# Altium schematic sheet DAC and MIC.SchDoc
size A4; SheetNumber: 5; SheetTotal: 10
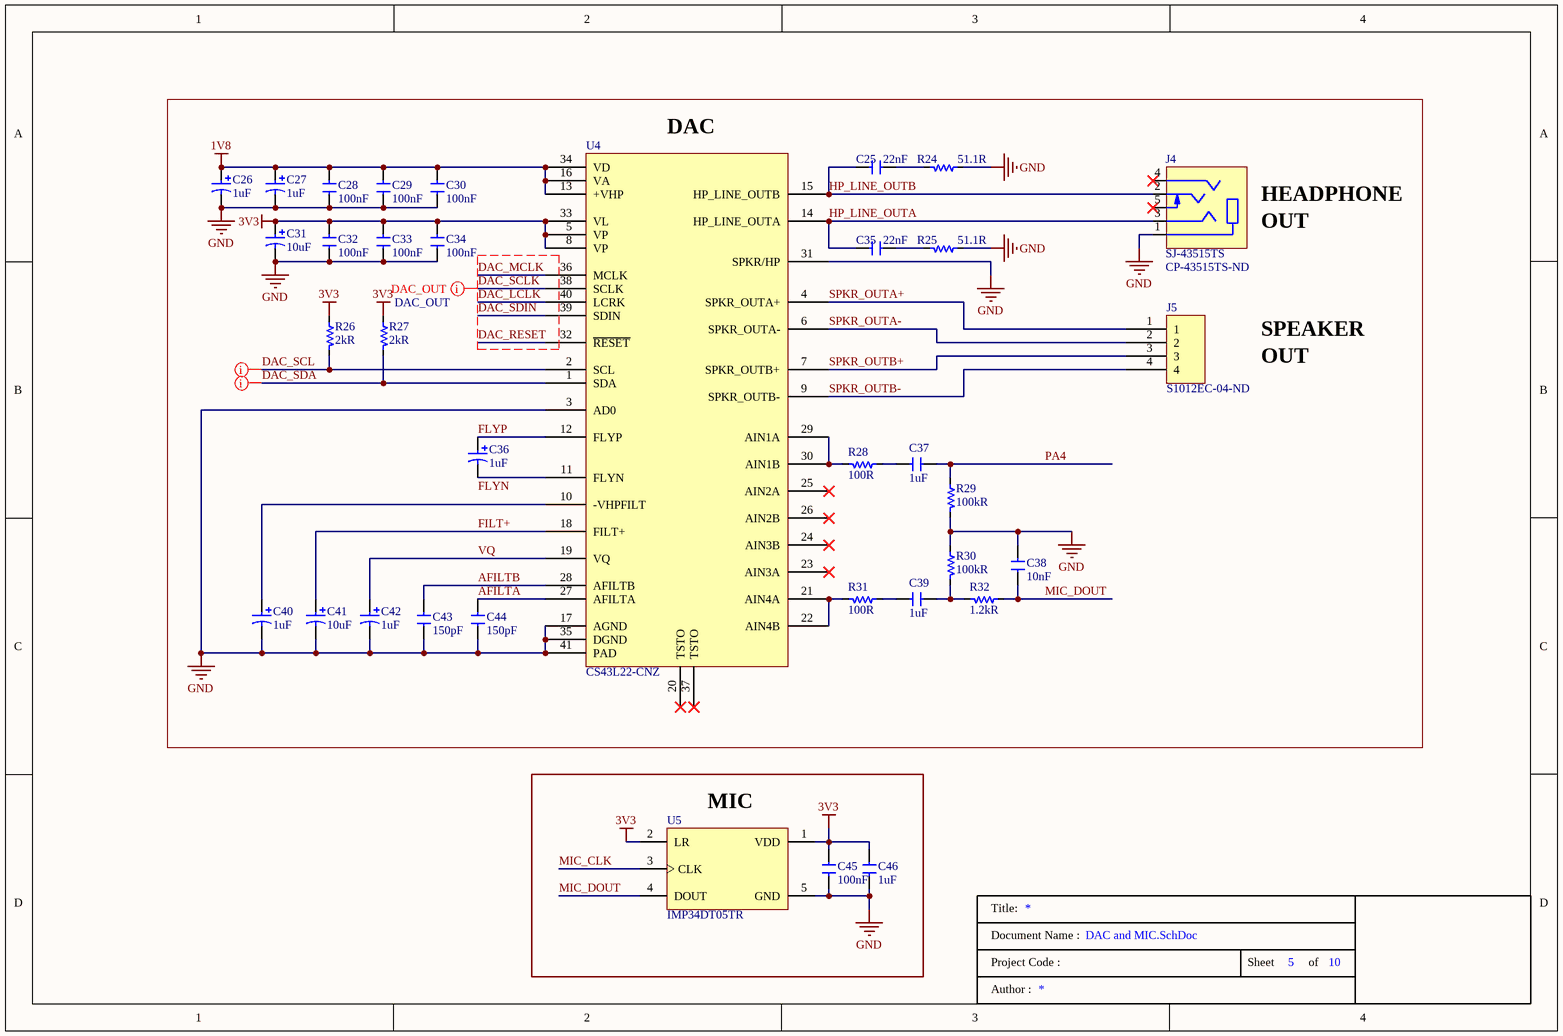
[diagram p0: DAC and MIC.SchDoc]

## Parts
C25  Capacitance: 22nF  [0805_CAP]  (hidden comment: CAP_22nF_50V_0805_X7R_CER)
C26  Capacitance: 1uF  [1206_TANT_CAP]  (hidden comment: CAP_1uF_10%_16V_1206_TANT)
C27  Capacitance: 1uF  [1206_TANT_CAP]  (hidden comment: CAP_1uF_10%_16V_1206_TANT)
C28  Capacitance: 100nF  [0805_CAP]  (hidden comment: CAP_0.1uF_50V_0805_X7R_CER)
C29  Capacitance: 100nF  [0805_CAP]  (hidden comment: CAP_0.1uF_50V_0805_X7R_CER)
C30  Capacitance: 100nF  [0805_CAP]  (hidden comment: CAP_0.1uF_50V_0805_X7R_CER)
C31  Capacitance: 10uF  [1206_TANT_CAP]  (hidden comment: CAP_10uF_10V_10%_1206_TANT)
C32  Capacitance: 100nF  [0805_CAP]  (hidden comment: CAP_0.1uF_50V_0805_X7R_CER)
C33  Capacitance: 100nF  [0805_CAP]  (hidden comment: CAP_0.1uF_50V_0805_X7R_CER)
C34  Capacitance: 100nF  [0805_CAP]  (hidden comment: CAP_0.1uF_50V_0805_X7R_CER)
C35  Capacitance: 22nF  [0805_CAP]  (hidden comment: CAP_22nF_50V_0805_X7R_CER)
C36  Capacitance: 1uF  [1206_TANT_CAP]  (hidden comment: CAP_1uF_10%_16V_1206_TANT)
C37  1uF  [0805_CAP]
C38  Capacitance: 10nF  [0805_CAP]  (hidden comment: CAP_10nF_%10_50V_0805_X7R_CER)
C39  1uF  [0805_CAP]
C40  Capacitance: 1uF  [1206_TANT_CAP]  (hidden comment: CAP_1uF_10%_16V_1206_TANT)
C41  Capacitance: 10uF  [1206_TANT_CAP]  (hidden comment: CAP_10uF_10V_10%_1206_TANT)
C42  Capacitance: 1uF  [1206_TANT_CAP]  (hidden comment: CAP_1uF_10%_16V_1206_TANT)
C43  Capacitance: 150pF  [0805_CAP]  (hidden comment: CAP_150pF_%5_50V_0805_C0G/NP0_CER)
C44  Capacitance: 150pF  [0805_CAP]  (hidden comment: CAP_150pF_%5_50V_0805_C0G/NP0_CER)
C45  Capacitance: 100nF  [0805_CAP]  (hidden comment: CAP_0.1uF_50V_0805_X7R_CER)
C46  1uF  [0805_CAP]
J4  SJ-43515TS  Supplier Part Number 1: CP-43515TS-ND  [CONN TRSS HEADPHONE JACK]
J5  Supplier Part Number 1: S1012EC-04-ND  [DIP_1X4_MALE_HEADER_2.54_PITCH]  (hidden comment: CONN_1X4_2.54mm_Male Header)
R24  Resistance: 51.1R  [0805_RES]  (hidden comment: RES_51.1 OHM_1%_0805_1/8W)
R25  Resistance: 51.1R  [0805_RES]  (hidden comment: RES_51.1 OHM_1%_0805_1/8W)
R26  Resistance: 2kR  [0805_RES]  (hidden comment: RES_2K OHM_1%_0805_1/8W_SMD)
R27  Resistance: 2kR  [0805_RES]  (hidden comment: RES_2K OHM_1%_0805_1/8W_SMD)
R28  Resistance: 100R  [0805_RES]  (hidden comment: RES_100 OHM_1%_0805_1/8W)
R29  100kR  [0805_RES]
R30  100kR  [0805_RES]
R31  Resistance: 100R  [0805_RES]  (hidden comment: RES_100 OHM_1%_0805_1/8W)
R32  1.2kR  [0805_RES]
U4  Manufacturer Part Number: CS43L22-CNZ  [QFN50P600X600X100_HS-41N]  (hidden comment: IC_CODEC_CS43L22)
U5  IMP34DT05TR  [MIC_IMP34DT05TR]

## Blocks framed on the sheet
MIC: C45 C46 U5

## Nets
1V8: C26.1 C27.1 C28.2 C29.2 C30.2 U4.13(+VHP) U4.16(VA) U4.34(VD)
3V3: C31.1 C32.2 C33.2 C34.2 C45.2 C46.2 R26.2 R27.2 U4.5(VP) U4.8(VP) U4.33(VL) U5.1(VDD) U5.2(LR)
GND: C26.2 C27.2 C28.1 C29.1 C30.1 C31.2 C32.1 C33.1 C34.1 C38.1 C40.2 C41.2 C42.2 C43.1 C44.1 C45.1 C46.1 J4.1(SLEEVE) R24.2 R25.2 R29.1 R30.2 U4.3(AD0) U4.17(AGND) U4.31(SPKR/HP) U4.35(DGND) U4.41(PAD) U5.5(GND)
AFILTA: C44.2 U4.27(AFILTA)
AFILTB: C43.2 U4.28(AFILTB)
DAC_LCLK: U4.40(LCRK)
DAC_MCLK: U4.36(MCLK)
DAC_RESET: U4.32(~{RESET})
DAC_SCL: R26.1 U4.2(SCL)
DAC_SCLK: U4.38(SCLK)
DAC_SDA: R27.1 U4.1(SDA)
DAC_SDIN: U4.39(SDIN)
FILT+: C41.1 U4.18(FILT+)
FLYN: C36.2 U4.11(FLYN)
FLYP: C36.1 U4.12(FLYP)
HP_LINE_OUTA: C35.1 J4.3(RING1) U4.14(HP_LINE_OUTA)
HP_LINE_OUTB: C25.1 J4.2(TIP) U4.15(HP_LINE_OUTB)
MIC_CLK: U5.3(CLK)
MIC_DOUT: C38.2 R32.2 U5.4(DOUT)
PA4: C37.2 R29.2
SPKR_OUTA+: J5.1 U4.4(SPKR_OUTA+)
SPKR_OUTA-: J5.2 U4.6(SPKR_OUTA-)
SPKR_OUTB+: J5.3 U4.7(SPKR_OUTB+)
SPKR_OUTB-: J5.4 U4.9(SPKR_OUTB-)
VQ: C42.1 U4.19(VQ)
NetC25_2: C25.2 R24.1
NetC35_2: C35.2 R25.1
NetC37_1: C37.1 R28.2
NetC39_1: C39.1 R31.2
NetC39_2: C39.2 R30.1 R32.1
NetC40_1: C40.1 U4.10(-VHPFILT)
NetR28_1: R28.1 U4.29(AIN1A) U4.30(AIN1B)
NetR31_1: R31.1 U4.21(AIN4A) U4.22(AIN4B)

Not connected (* = marked no-connect by the designer): J4 4(RING2)* 5(TIP_SWITCH)*; U4 20(TSTO)* 23(AIN3A)* 24(AIN3B)* 25(AIN2A)* 26(AIN2B)* 37(TSTO)*

## Layout directives
net class DAC_OUT: DAC_SCL, DAC_SCLK, DAC_SDA

## Notes on the sheet
- (near U4) DAC
- HEADPHONE
- OUT
- SPEAKER
- Title:
- Document Name :
- Project Code :
- Sheet
- of
- Author :

## Library data of the parts
C25 C35 = CAP_22nF_50V_0805_X7R_CER: Cap Ceramic 0.022uF 50V X7R 10% Pad SMD 0805 125C T/R; Manufacturer: KEMET; Manufacturer Part Number: C0805C223K5RAC7210; Supplier 1: Digi-Key; RoHS: Yes; Category: Ceramic Capacitors; Stock 1: 39697; Pricing 1: 1=0,10000, 10=0,05200, 50=0,02840, 100=0,02320, 500=0,01656, 1000=0,01301, 2500=0,01182, 5000=0,01088 (USD); Mount: Surface Mount; Case/Package: 0805; Dielectric Material: Ceramic; Min Operating Temperature: -55°C; Max Operating Temperature: 125°C; Tolerance: 10%; Dielectric: X7R; Packaging: Tape and Reel; Voltage Rating (DC): 50V; Construction: Flat; Length: 2mm; Height: 0.78mm; Depth: 1.25mm; Radiation Hardening: No; RoHS Compliant: Yes; ComponentLink1URL: http://components.arrow.com/part/dataview/3451368S8809735N7429?src-supplier=Arrow+Electronics; ComponentLink1Description: http://components.arrow.com/part/dataview/3451368S8809735N7429?src-supplier=Arrow+Electronics; ComponentLink2URL: https://www.verical.com/server-webapp/html/getDatasheet?partID=104142&src-supplier=Verical; ComponentLink2Description: https://www.verical.com/server-webapp/html/getDatasheet?partID=104142&src-supplier=Verical; Supplier Part Number 1: 399-C0805C223K5RAC7210CT-ND
C26 C27 C36 C40 C42 = CAP_1uF_10%_16V_1206_TANT: CAP TANT 1UF 10% 16V 1206; Manufacturer: Kyocera AVX; Manufacturer Part Number: TAJA105K016SNJ; Dielectric Material: Tantalum; Polarity: Polar; ESR (Equivalent Series Resistance): 11R; Dissipation Factor: 4%; RoHS: Yes; Category: Tantalum Capacitors; Stock 1: 6536; Pricing 1: 1=0,34000, 10=0,23300, 50=0,16300, 100=0,13970, 500=0,10480, 1000=0,08849, 2500=0,08384 (USD); Mount: Surface Mount; Case/Package: 1206; Number of Pins: 2; Case Code (Imperial): 1206; Case Code (Metric): 3216; Min Operating Temperature: -55°C; Max Operating Temperature: 125°C; Termination: SMD/SMT; Features: General Purpose; Tolerance: 10%; Voltage Rating (DC): 16V; Packaging: Tape and Reel; Package Quantity: 1; Voltage Rating: 16V; Length: 3.2mm; Width: 1.6mm; Height: 1.8mm; Height - Seated (Max): 0.071inch; Depth: 1.6mm; Radiation Hardening: No; Lead Free: Lead Free; ComponentLink1URL: https://datasheet.ciiva.com/12883/taj-27497-12883493.pdf?src-supplier=Mouser; ComponentLink1Description: https://datasheet.ciiva.com/12883/taj-27497-12883493.pdf?src-supplier=Mouser; ComponentLink2URL: https://datasheet.ciiva.com/6228/taj-6228987.pdf?src-supplier=Digi-Key; ComponentLink2Description: https://datasheet.ciiva.com/6228/taj-6228987.pdf?src-supplier=Digi-Key; ComponentLink3URL: https://datasheet.ciiva.com/6228/taj-6228988.pdf?src-supplier=Digi-Key; ComponentLink3Description: https://datasheet.ciiva.com/6228/taj-6228988.pdf?src-supplier=Digi-Key; ComponentLink4URL: https://datasheet.ciiva.com/6228/taj-6228989.pdf?src-supplier=Digi-Key; ComponentLink4Description: https://datasheet.ciiva.com/6228/taj-6228989.pdf?src-supplier=Digi-Key; Supplier Part Number 1: 478-7525-1-ND; Supplier 1: Digi-Key
C28-C30 C32-C34 C45 = CAP_0.1uF_50V_0805_X7R_CER: Cap Ceramic 0.1uF 50V X7R 20% SMD 0805 125C Paper T/R; Manufacturer: KEMET; Manufacturer Part Number: C0805C104M5RACTU; Supplier 1: Digi-Key; RoHS: Yes; Category: Ceramic Capacitors; Stock 1: 4863; Pricing 1: 1=0,10000, 10=0,06400, 50=0,03500, 100=0,02860, 500=0,02040, 1000=0,01603 (USD); Mount: Surface Mount; Case/Package: 0805; Dielectric Material: Ceramic; Min Operating Temperature: -55°C; Max Operating Temperature: 125°C; Tolerance: 20%; Dielectric: X7R; Packaging: Tape and Reel; Voltage Rating (DC): 50V; Length: 2mm; Height: 0.9mm; Depth: 1.25mm; Radiation Hardening: No; ComponentLink1URL: http://uk.rs-online.com/webdocs/13da/0900766b813daa06.pdf?src-supplier=RSComponents; ComponentLink1Description: http://uk.rs-online.com/webdocs/13da/0900766b813daa06.pdf?src-supplier=RSComponents; ComponentLink2URL: https://www.verical.com/server-webapp/html/getDatasheet?partID=774625&src-supplier=Verical; ComponentLink2Description: https://www.verical.com/server-webapp/html/getDatasheet?partID=774625&src-supplier=Verical; ComponentLink3URL: http://www.farnell.com/datasheets/2739857.pdf?src-supplier=Farnell; ComponentLink3Description: http://www.farnell.com/datasheets/2739857.pdf?src-supplier=Farnell; ComponentLink4URL: http://uk.rs-online.com/webdocs/1515/0900766b81515223.pdf?src-supplier=RSComponents; ComponentLink4Description: http://uk.rs-online.com/webdocs/1515/0900766b81515223.pdf?src-supplier=RSComponents; ComponentLink5URL: http://components.arrow.com/part/dataview/0323_00324812?src-supplier=Arrow+Europe; ComponentLink5Description: http://components.arrow.com/part/dataview/0323_00324812?src-supplier=Arrow+Europe; ComponentLink6URL: http://uk.rs-online.com/webdocs/1528/0900766b81528e2f.pdf?src-supplier=RSComponents; ComponentLink6Description: http://uk.rs-online.com/webdocs/1528/0900766b81528e2f.pdf?src-supplier=RSComponents; ComponentLink7URL: http://www.farnell.com/datasheets/2739857.pdf?src-supplier=Newark; ComponentLink7Description: http://www.farnell.com/datasheets/2739857.pdf?src-supplier=Newark; ComponentLink8URL: http://www.alliedelec.com/m/d/9bfe7773041ffe9d406e68bc7b377fdd.pdf?src-supplier=Allied+Electronics; ComponentLink8Description: http://www.alliedelec.com/m/d/9bfe7773041ffe9d406e68bc7b377fdd.pdf?src-supplier=Allied+Electronics; ComponentLink9URL: https://api.kemet.com/component-edge/download/datasheet/C0805C104M5RACTU.pdf?src-supplier=Digi-Key; ComponentLink9Description: https://api.kemet.com/component-edge/download/datasheet/C0805C104M5RACTU.pdf?src-supplier=Digi-Key; ComponentLink10URL: http://capacitoredge.kemet.com/capedge2/DataSheet?pn=C0805C104M5RACTU&src-supplier=Avnet+Europe; ComponentLink10Description: http://capacitoredge.kemet.com/capedge2/DataSheet?pn=C0805C104M5RACTU&src-supplier=Avnet+Europe; ComponentLink11URL: http://www.farnell.com/datasheets/2739857.pdf?src-supplier=Element14; ComponentLink11Description: http://www.farnell.com/datasheets/2739857.pdf?src-supplier=Element14; ComponentLink12URL: http://www.mouser.com/ds/2/212/KEM_C1002_X7R_SMD-1102033.pdf?src-supplier=Mouser; ComponentLink12Description: http://www.mouser.com/ds/2/212/KEM_C1002_X7R_SMD-1102033.pdf?src-supplier=Mouser; ComponentLink13URL: https://www.verical.com/server-webapp/html/getDatasheet?partID=91523&src-supplier=Verical; ComponentLink13Description: https://www.verical.com/server-webapp/html/getDatasheet?partID=91523&src-supplier=Verical; ComponentLink14URL: http://components.arrow.com/part/dataview/2091108S8109171N7429?src-supplier=Arrow+Electronics; ComponentLink14Description: http://components.arrow.com/part/dataview/2091108S8109171N7429?src-supplier=Arrow+Electronics; Supplier Part Number 1: 399-C0805C104M5RAC7800CT-ND
C31 C41 = CAP_10uF_10V_10%_1206_TANT: Cap Tant Solid 10uF 10V A CASE 10% (3.2 X 1.6 X 1.6mm) Inward L SMD 3216-18 3 Ohm 125C T/R; Manufacturer: Kyocera AVX; Manufacturer Part Number: TAJA106K010SNJ; ESR (Equivalent Series Resistance): 3R; Leakage Current: 1uA; Polarity: Polar; Dissipation Factor: 6%; Supplier 1: Digi-Key; RoHS: Yes; Category: Tantalum Capacitors; Stock 1: 14579; Pricing 1: 1=0,31000, 10=0,21300, 50=0,14920, 100=0,12780, 500=0,09584, 1000=0,08094, 2500=0,07668 (USD); Case/Package: Molded; Number of Pins: 2; Case Code (Imperial): 1206; Case Code (Metric): 3216; Min Operating Temperature: -55°C; Max Operating Temperature: 125°C; Tolerance: 10%; Packaging: Tape and Reel; Voltage Rating: 10V; Package Quantity: 8000; Termination: SMD/SMT; Voltage Rating (DC): 10V; Series: TAJ; Construction: Flat; Length: 3.2mm; Width: 1.6mm; Height: 1.8mm; Depth: 1.6mm; Radiation Hardening: No; Lead Free: Lead Free; RoHS Compliant: Yes; ComponentLink1URL: https://datasheet.ciiva.com/12909/taj-27497-12909898.pdf?src-supplier=Mouser; ComponentLink1Description: https://datasheet.ciiva.com/12909/taj-27497-12909898.pdf?src-supplier=Mouser; Supplier Part Number 1: 478-13122-1-ND
C37 C39 C46 = CAP_1uF_%10_25V_0805_X7R_CER: 陶瓷电容 1uF(105) 1uF ±10% 25V 0805; Manufacturer: Samsung; Manufacturer Part Number: CL21B105KAFNNNG; Material: Ceramic; Dielectric: X7R; Supplier 1: Digi-Key; RoHS: Yes; Category: Ceramic Capacitors; Stock 1: 509034; Pricing 1: 1=0,10000, 10=0,07100, 50=0,03880, 100=0,03170, 500=0,02264, 1000=0,01779 (USD); Mount: Surface Mount; Case/Package: 0805; Case Code (Metric): 2012; Case Code (Imperial): 0805; Min Operating Temperature: -55°C; Max Operating Temperature: 125°C; Tolerance: 10%; Capacitance: 1uF; Voltage Rating: 25V; Package Quantity: 3000; Packaging: Tape and Reel; Voltage: 25V; Series: CL; Length: 2mm; Width: 0.049inch; Height: 1.25mm; Thickness: 0.053inch; Depth: 1.25mm; Radiation Hardening: No; RoHS Compliant: Yes; ComponentLink1URL: https://datasheet.ciiva.com/26920/getdatasheetpartid-698495-26920200.pdf?src-supplier=Verical; ComponentLink1Description: https://datasheet.ciiva.com/26920/getdatasheetpartid-698495-26920200.pdf?src-supplier=Verical; ComponentLink2URL: https://datasheet.ciiva.com/29199/455911-da-01-en-vs-kondensator-0805-29199043.pdf?src-supplier=Conrad; ComponentLink2Description: https://datasheet.ciiva.com/29199/455911-da-01-en-vs-kondensator-0805-29199043.pdf?src-supplier=Conrad; ComponentLink3URL: https://datasheet.ciiva.com/16428/cl05b104kq5nnnc-16428871.pdf?src-supplier=Future+Electronics; ComponentLink3Description: https://datasheet.ciiva.com/16428/cl05b104kq5nnnc-16428871.pdf?src-supplier=Future+Electronics; Supplier Part Number 1: 1276-6469-1-ND
C38 = CAP_10nF_%10_50V_0805_X7R_CER: CAP CER 10000PF 50V X7R 0805; Manufacturer: Samsung; Manufacturer Part Number: CL21B103KBANNNC; Material: Ceramic; Tolerance: 10%; Supplier 1: Digi-Key; RoHS: Yes; Category: Ceramic Capacitors; Stock 1: 1431273; Pricing 1: 1=0,10000, 10=0,04600, 50=0,02500, 100=0,02050, 500=0,01464, 1000=0,01150 (USD); Mount: Surface Mount; Case/Package: 0805; Case Code (Metric): 2012; Case Code (Imperial): 0805; Contact Plating: Tin; Min Operating Temperature: -55°C; Max Operating Temperature: 125°C; Dielectric: X7R; Voltage: 50V; Voltage Rating (DC): 50V; Packaging: Tape and Reel; Voltage Rating: 50V; Series: CL; Construction: Flat; Length: 2mm; Width: 0.049inch; Height: 0.65mm; Depth: 1.25mm; Thickness: 0.03inch; Radiation Hardening: No; Lead Free: Lead Free; RoHS Compliant: Yes; ComponentLink1URL: https://datasheet.ciiva.com/25709/cl21b103kbannnc-25709781.pdf?src-supplier=Digi-Key; ComponentLink1Description: https://datasheet.ciiva.com/25709/cl21b103kbannnc-25709781.pdf?src-supplier=Digi-Key; ComponentLink2URL: https://datasheet.ciiva.com/29199/455082-da-01-en-vs-kondensator-0805-29199459.pdf?src-supplier=Conrad; ComponentLink2Description: https://datasheet.ciiva.com/29199/455082-da-01-en-vs-kondensator-0805-29199459.pdf?src-supplier=Conrad; Supplier Part Number 1: 1276-1015-1-ND
C43 C44 = CAP_150pF_%5_50V_0805_C0G/NP0_CER: 陶瓷电容 150pF(151) 150pF ±5% 50V C0G(NP0) 0805; Manufacturer: KEMET; Manufacturer Part Number: C0805C151J5GACTU; Dielectric Material: Ceramic; Dissipation Factor: 0.1%; Temperature Coefficient: 30ppm/°C; Supplier 1: Digi-Key; RoHS: Yes; Category: Ceramic Capacitors; Stock 1: 90347; Pricing 1: 1=0,10000, 10=0,06800, 50=0,03700, 100=0,03020, 500=0,02156, 1000=0,01694 (USD); Mount: Surface Mount,PCB; Case/Package: 0805; Number of Pins: 2; Case Code (Metric): 2012; Case Code (Imperial): 0805; Contact Material: Tin; Min Operating Temperature: -55°C; Max Operating Temperature: 125°C; Tolerance: 5%; Dielectric: NP0; Package Quantity: 1; Voltage Rating: 50V; Packaging: Tape and Reel; Voltage Rating (DC): 50V; Termination: SMD/SMT; Voltage: 50V; Series: C; Construction: Flat; Length: 2mm; Width: 0.049inch; Height: 0.78mm; Depth: 1.25mm; Thickness: 0.035inch; Lead Pitch: 0.75mm; Radiation Hardening: No; Lead Free: Lead Free; RoHS Compliant: Yes; REACH SVHC: No SVHC; ComponentLink1URL: https://datasheet.ciiva.com/7842/1776095-7842215.pdf?src-supplier=Element14; ComponentLink1Description: https://datasheet.ciiva.com/7842/1776095-7842215.pdf?src-supplier=Element14; ComponentLink2URL: https://datasheet.ciiva.com/144/docfinderpartnumber-c0805c151j5gactu-144656.pdf?src-supplier=Digi-Key; ComponentLink2Description: https://datasheet.ciiva.com/144/docfinderpartnumber-c0805c151j5gactu-144656.pdf?src-supplier=Digi-Key; ComponentLink3URL: https://datasheet.ciiva.com/7842/1372242-7842559.pdf?src-supplier=Element14; ComponentLink3Description: https://datasheet.ciiva.com/7842/1372242-7842559.pdf?src-supplier=Element14; ComponentLink4URL: https://datasheet.ciiva.com/28668/1789732-28668745.pdf?src-supplier=Element14; ComponentLink4Description: https://datasheet.ciiva.com/28668/1789732-28668745.pdf?src-supplier=Element14; ComponentLink5URL: https://datasheet.ciiva.com/14604/70095383-14604153.pdf?src-supplier=Allied+Electronics; ComponentLink5Description: https://datasheet.ciiva.com/14604/70095383-14604153.pdf?src-supplier=Allied+Electronics; ComponentLink6URL: https://datasheet.ciiva.com/14597/70095383-14597037.pdf?src-supplier=Allied+Electronics; ComponentLink6Description: https://datasheet.ciiva.com/14597/70095383-14597037.pdf?src-supplier=Allied+Electronics; ComponentLink7URL: https://datasheet.ciiva.com/2988/kem-c1003-c0g-smd-2988611.pdf?src-supplier=Avnet; ComponentLink7Description: https://datasheet.ciiva.com/2988/kem-c1003-c0g-smd-2988611.pdf?src-supplier=Avnet; ComponentLink8URL: https://datasheet.ciiva.com/2988/kem-c1003-c0g-smd-2988612.pdf?src-supplier=Avnet; ComponentLink8Description: https://datasheet.ciiva.com/2988/kem-c1003-c0g-smd-2988612.pdf?src-supplier=Avnet; Supplier Part Number 1: 399-C0805C151J5GAC7800CT-ND
J4 = CONN_JACK_4COND_3.5MM_R/A: Conn 3.5MM Audio Jack RCP 5 POS RA Thru-Hole 5 Terminal 1 Port; Manufacturer: CUI Devices; Supplier 1: Digi-Key; Manufacturer Part Number: SJ-43515TS; RoHS: Yes; Category: Audio / Video Connectors; Stock 1: 36318; Pricing 1: 1=1,04000, 10=0,87500, 25=0,83880, 40=0,82100, 80=0,78538, 270=0,71400, 540=0,64259, 1080=0,57120, 2430=0,51765 (USD)
J5 = CONN_1X4_2.54mm_Male Header: Connector Header Through Hole 4 position 0.100" (2.54mm); Manufacturer: Sullins; Manufacturer Part Number: PREC004SAAN-RC; Number of Positions: 4; Connector Type: Male Pin; Pitch: 0.1inch; Supplier 1: Digi-Key; RoHS: Yes; Category: Connectors; Stock 1: 2512; Pricing 1: 1=0,12000, 10=0,11200, 25=0,08320, 50=0,07120, 100=0,06890, 250=0,05940, 500=0,05702 (USD); Mount: Through Hole; Color: Black; Contact Plating: Tin; Package Quantity: 1; Number of Rows: 1; Packaging: Bulk; Termination: Solder; Series: -; Contact Type: Male Pin; Contact Mating Length: 0.23inch; RoHS Compliant: Yes; ComponentLink1URL: https://datasheet.ciiva.com/740/zrzczzzszzn-rc-st-11635-b-740841.pdf?src-supplier=Digi-Key; ComponentLink1Description: https://datasheet.ciiva.com/740/zrzczzzszzn-rc-st-11635-b-740841.pdf?src-supplier=Digi-Key
R24 R25 = RES_51.1 OHM_1%_0805_1/8W: 贴片电阻 51.1Ω ± 1.00% 0.125W ± 100ppm/℃ 0805; Manufacturer: Yageo; Manufacturer Part Number: RC0805FR-0751R1L; Tolerance: 1%; Power Rating: 125mW; Voltage Rating: 150V; Temperature Coefficient: 100ppm/°C; Supplier 1: Digi-Key; RoHS: Yes; Category: Chip SMD Resistors; Stock 1: 4296; Pricing 1: 1=0,10000, 10=0,04200, 100=0,01690, 1000=0,00759, 2500=0,00659 (USD); Case/Package: 0805; Case Code (Imperial): 0805; Case Code (Metric): 2012; Min Operating Temperature: -55°C; Max Operating Temperature: 155°C; Packaging: Tape and Reel; Package Quantity: 5000; Termination: SMD/SMT; Resistor Type: Thick Film; Voltage Rating (DC): 150V; Working Voltage: 150V; Number of Terminations: 2; Features: Moisture Resistant; Series: RC; Max Power Dissipation: 125mW; Construction: Rectangular; Technology: THICK FILM; Length: 2mm; Width: 1.25mm; Height: 0.5mm; Depth: 1.25mm; Military Standard: Not; Lead Free: Lead Free; RoHS Compliant: Yes; ComponentLink1URL: https://datasheet.ciiva.com/12558/rc0805-257173-12558456.pdf?src-supplier=Mouser; ComponentLink1Description: https://datasheet.ciiva.com/12558/rc0805-257173-12558456.pdf?src-supplier=Mouser; ComponentLink2URL: https://datasheet.ciiva.com/16740/rc0805-16740910.pdf?src-supplier=Future+Electronics; ComponentLink2Description: https://datasheet.ciiva.com/16740/rc0805-16740910.pdf?src-supplier=Future+Electronics; Supplier Part Number 1: 311-51.1CRCT-ND
R26 R27 = RES_2K OHM_1%_0805_1/8W_SMD: Res Thick Film 0805 2K Ohm 1% 0.125W(1/8W) ±100ppm/C Pad SMD Automotive T/R; Manufacturer: Yageo; Manufacturer Part Number: AC0805FR-072KL; Voltage Rating: 150V; Power Rating: 125mW; Temperature Coefficient: 100ppm/°C; Supplier 1: Digi-Key; RoHS: Yes; Category: Chip SMD Resistors; Stock 1: 98521; Pricing 1: 1=0,10000, 10=0,05000, 100=0,02040, 1000=0,00917, 2500=0,00796 (USD); Case/Package: 0805; Case Code (Imperial): 0805; Case Code (Metric): 2012; Weight: 0.000194oz; Min Operating Temperature: -55°C; Max Operating Temperature: 155°C; Packaging: Tape and Reel; Tolerance: 1%; Resistor Type: Thick Film; Termination: SMD/SMT; Number of Terminations: 2; Max Power Dissipation: 125mW; Features: Moisture Resistant,Automotive AEC-Q200; Series: AC; Length: 0.079inch; Width: 1.25mm; Height: 0.024inch; RoHS Compliant: Yes; ComponentLink1URL: https://datasheet.ciiva.com/12576/pyu-ac-51-rohs-l-2-12576581.pdf?src-supplier=Mouser; ComponentLink1Description: https://datasheet.ciiva.com/12576/pyu-ac-51-rohs-l-2-12576581.pdf?src-supplier=Mouser; Supplier Part Number 1: YAG3718CT-ND
R28 R31 = RES_100 OHM_1%_0805_1/8W: 贴片电阻 100Ω ± 1.00% 0.125W ± 100ppm/℃ 0805; Manufacturer: Yageo; Manufacturer Part Number: RC0805FR-07100RL; Power Rating: 125mW; Tolerance: 1%; Voltage Rating: 150V; Temperature Coefficient: 100ppm/°C; Application(s): HIGH RELIABILITY; Supplier 1: Digi-Key; RoHS: Yes; Category: Chip SMD Resistors; Stock 1: 3418646; Pricing 1: 1=0,10000, 10=0,04200, 100=0,01690, 1000=0,00759, 2500=0,00659 (USD); Case/Package: 0805; Number of Pins: 2; Case Code (Imperial): 0805; Case Code (Metric): 2012; Weight: 0.000917oz; Min Operating Temperature: -55°C; Max Operating Temperature: 155°C; Packaging: Cut Tape; Package Quantity: 5000; Termination: SMD/SMT; Resistor Type: Thick Film; Number of Terminations: 2; Max Power Dissipation: 125mW; Features: Moisture Resistant; Series: RC; Technology: THICK FILM; Voltage Rating (DC): 150V; Type: General Purpose; Length: 2mm; Width: 1.25mm; Height: 0.5mm; Depth: 1.25mm; Lead Pitch: 0.4mm; REACH SVHC: Unknown; Lead Free: Lead Free; RoHS Compliant: Yes; Military Standard: Not; ComponentLink1URL: https://datasheet.ciiva.com/11808/0900766b8106beab-11808877.pdf?src-supplier=RSComponents; ComponentLink1Description: https://datasheet.ciiva.com/11808/0900766b8106beab-11808877.pdf?src-supplier=RSComponents; ComponentLink2URL: https://datasheet.ciiva.com/7941/1697719-7941680.pdf?src-supplier=Element14; ComponentLink2Description: https://datasheet.ciiva.com/7941/1697719-7941680.pdf?src-supplier=Element14; ComponentLink3URL: https://datasheet.ciiva.com/7660/38627-7660797.pdf?src-supplier=Element14; ComponentLink3Description: https://datasheet.ciiva.com/7660/38627-7660797.pdf?src-supplier=Element14; ComponentLink4URL: https://datasheet.ciiva.com/2456/pyu-r-int-thick-7-2456987.pdf?src-supplier=Digi-Key; ComponentLink4Description: https://datasheet.ciiva.com/2456/pyu-r-int-thick-7-2456987.pdf?src-supplier=Digi-Key; Supplier Part Number 1: 311-100CRCT-ND
R29 R30 = RES_100K OHM_1%_0805_1/8W: CRCW Thick Film Commodity Chip Resistor 0805 Size 100K Ohm 1% 0.125 W 100 ppm/K 2-Pin SMD Paper T/R; Manufacturer: Vishay; Manufacturer Part Number: CRCW0805100KFKEBC; Max Power Dissipation: 125mW; Temperature Coefficient: 100ppm/°C; Supplier 1: Digi-Key; RoHS: Yes; Category: Chip SMD Resistors; Stock 1: 46130; Pricing 1: 1=0,10000, 10=0,06300, 100=0,02540, 1000=0,01143, 2500=0,00992, 5000=0,00819 (USD); Case/Package: 0805; Min Operating Temperature: -55°C; Max Operating Temperature: 155°C; Resistor Type: Thick Film; Packaging: Tape and Reel; Resistance: 100kR; Tolerance: 1%; Number of Terminations: 2; RoHS Compliant: Yes; ComponentLink1URL: http://www.vishay.com/docs/28773/crcwce3.pdf?src-supplier=Digi-Key; ComponentLink1Description: http://www.vishay.com/docs/28773/crcwce3.pdf?src-supplier=Digi-Key; Supplier Part Number 1: 541-CRCW0805100KFKEBCCT-ND
R32 = RES_1.2K OHM_1%_0805_1/8W: Res Thick Film 0805 1.2K Ohm 1% 1/8W ±100ppm/°C Molded SMD Paper T/R; Manufacturer: Vishay Semiconductors; Manufacturer Part Number: CRCW08051K20FKEAC; Power Rating: 125mW; Supplier 1: Digi-Key; RoHS: Yes; Category: Chip SMD Resistors; Stock 1: 750; Pricing 1: 1=0,10000, 10=0,06300, 100=0,02540, 1000=0,01143, 2500=0,00992 (USD); Mount: Surface Mount; Case/Package: Molded; Contact Plating: Tin; Min Operating Temperature: -55°C; Max Operating Temperature: 155°C; Resistor Type: Thick Film; Termination: Wraparound; Resistance: 1.2kR; Tolerance: 1%; Temperature Coefficient: 100ppm/°C; Length: 2mm; Lead Free: Lead Free; RoHS Compliant: Yes; Supplier Part Number 1: 541-CRCW08051K20FKEACCT-ND
U4 = IC_CODEC_CS43L22: DAC 1-CH Delta-Sigma 24-bit 40-Pin QFN EP Rail; Manufacturer: Cirrus Logic; Interface: I2C,Serial; Resolution: 24b; Number of DAC Channels: 1; Sampling Rate: 96000S/s; Conversion Rate: 96KS/s; Number of Bits: 24; Output Type: Voltage; Max Supply Voltage: 2.63V; Min Supply Voltage: 1.65V; Operating Supply Voltage: 2.5V; Polarity: Bipolar; Supply Type: Analog,Digital; Supplier 1: Digi-Key; RoHS: Yes; Category: Digital to Analog Converters (DACs); Pricing 1: 1=6,46000, 10=5,83400, 25=5,56280, 100=4,83020, 250=4,61312, 500=4,20608, 1000=3,84000 (USD); Mount: Surface Mount; Case/Package: QFN; Number of Pins: 40; Contact Plating: Tin,Matte; Min Operating Temperature: -40°C; Max Operating Temperature: 85°C; Package Quantity: 50; Packaging: Tray; Number of Converters: 1; Number of Channels: 1; Output Polarity: Bipolar; Series: -; Length: 6mm; Width: 6mm; Height: 0.95mm; RoHS Compliant: Yes; ComponentLink1URL: https://datasheet.ciiva.com/1494/91818-1494314.pdf?src-supplier=Element14; ComponentLink1Description: https://datasheet.ciiva.com/1494/91818-1494314.pdf?src-supplier=Element14; ComponentLink2URL: https://datasheet.ciiva.com/26802/cs43l22-cnz-26802243.pdf?src-supplier=IIIC; ComponentLink2Description: https://datasheet.ciiva.com/26802/cs43l22-cnz-26802243.pdf?src-supplier=IIIC; ComponentLink3URL: https://datasheet.ciiva.com/6665/cs43l22-f2-6665692.pdf?src-supplier=Digi-Key; ComponentLink3Description: https://datasheet.ciiva.com/6665/cs43l22-f2-6665692.pdf?src-supplier=Digi-Key; ComponentLink4URL: https://datasheet.ciiva.com/3040/cs43l22-f2-3040429.pdf?src-supplier=Avnet; ComponentLink4Description: https://datasheet.ciiva.com/3040/cs43l22-f2-3040429.pdf?src-supplier=Avnet; ComponentLink5URL: https://datasheet.ciiva.com/16606/cs43l22-f2-16606863.pdf?src-supplier=Avnet+Europe; ComponentLink5Description: https://datasheet.ciiva.com/16606/cs43l22-f2-16606863.pdf?src-supplier=Avnet+Europe; Supplier Part Number 1: 598-1650-ND
U5 = MIC_IMP34DT05TR: IMP34DT05: 3.6V MEMS Audio Sensor Omnidirectional Digital Microphone - HCLGA-4LD; Manufacturer: STMicroelectronics; Shape: Rectangular; Voltage Rating: 1.8V; Operating Supply Current: 650uA; Supplier 1: Digi-Key; Manufacturer Part Number: IMP34DT05TR; RoHS: Yes; Category: Microphones; Stock 1: 3742; Pricing 1: 1=2,62000, 10=2,35700, 25=2,22320, 100=1,89430, 500=1,55636, 1000=1,48225 (USD); Output Type: Digital; Direction: Omnidirectional; Packaging: Tape and Reel; Termination: Solder; RoHS Compliant: Yes; ComponentLink1URL: https://www.st.com/resource/en/datasheet/imp34dt05.pdf?src-supplier=Digi-Key; ComponentLink1Description: https://www.st.com/resource/en/datasheet/imp34dt05.pdf?src-supplier=Digi-Key; Supplier Part Number 1: 497-18183-1-ND